# EAGLE schematic node (EAGLE 8.1.0)
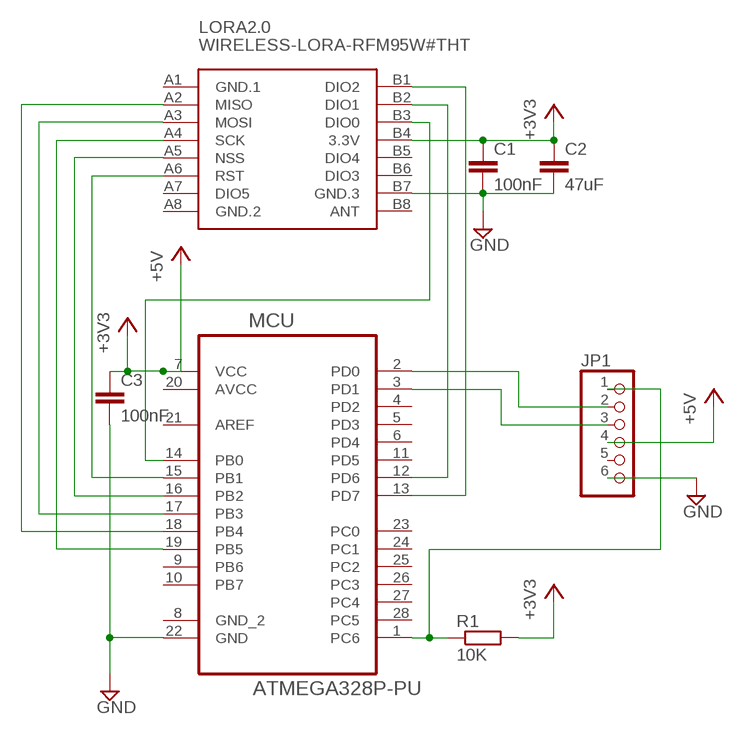
[diagram p0: schematic, sheet 1]

## Parts
C1  100nF  C-EU025-025X050  [C025-025X050]
C2  47uF  C-EU025-025X050  [C025-025X050]
C3  100nF  C-EU025-025X050  [C025-025X050]
JP1  PINHD-1X6  [1X06]
LORA2.0  WIRELESS-LORA-RFM95W#THT  [WIRELESS-LORA-RFM95W#THT]
MCU  ATMEGA328P-PU  [DIP254P762X457-28]
R1  10K  R-EU_0204/7  [0204/7]

## Nets
+3V3: C1.1 C2.1 C3.1 LORA2.0.B4(3.3V) MCU.7(VCC) R1.2 ; supply symbol labelled +5V
+5V: JP1.4
GND: C1.2 C2.2 C3.2 JP1.6 LORA2.0.B7(GND.3) MCU.22(GND)
N$1: LORA2.0.A2(MISO) MCU.18(PB4)
N$2: LORA2.0.A3(MOSI) MCU.17(PB3)
N$3: LORA2.0.A5(NSS) MCU.16(PB2)
N$4: LORA2.0.A4(SCK) MCU.19(PB5)
N$5: JP1.1 MCU.1(PC6) R1.1
N$6: JP1.2 MCU.2(PD0)
N$7: JP1.3 MCU.3(PD1)
N$8: LORA2.0.A6(RST) MCU.15(PB1)
N$9: LORA2.0.B3(DIO0) MCU.14(PB0)
N$10: LORA2.0.B2(DIO1) MCU.12(PD6)
N$11: LORA2.0.B1(DIO2) MCU.13(PD7)
Unconnected: JP1.5 LORA2.0.A7(DIO5) LORA2.0.B5(DIO4) LORA2.0.B6(DIO3) LORA2.0.B8(ANT) MCU.4(PD2) MCU.5(PD3) MCU.6(PD4) MCU.8(GND_2) MCU.9(PB6) MCU.10(PB7) MCU.11(PD5) MCU.21(AREF) MCU.23(PC0) MCU.24(PC1) MCU.25(PC2) MCU.26(PC3) MCU.27(PC4) MCU.28(PC5)

## Power pins joined to a net without a drawn wire
AVCC: MCU.20(AVCC)
GND.1: LORA2.0.A1(GND.1)
GND.2: LORA2.0.A8(GND.2)

## Library data of the parts
C1-C3 = resistor:C-EU: CAPACITOR, European symbol
JP1 = pinhead:PINHD-1X6: PIN HEADER
LORA2.0 = diy-modules:WIRELESS-LORA-RFM95W: 868/915 MHz LoRa Radio Transceiver Module based on SX1276 chip Click here to find device on ebay.com <http://www.ebay.com/sch/RFM95W+transceiver>
MCU = Atmel_By_element14_Batch_1-00:ATMEGA328P-PU: 8-bit Microcontroller with In-System Programmable Flash; MPN: ATMEGA328P-PU; OC_FARNELL: 1715487; OC_NEWARK: 15R0268; PACKAGE: PDIP-28; SUPPLIER: Atmel
R1 = resistor:R-EU_: RESISTOR, European symbol